# Altium schematic sheet Main_Sch.SchDoc: Controlador PID
size A4; Organization: Altium Limited; Address1: L3, 12a Rodborough Rd; Address2: Frenchs Forest; Address3: NSW; Address4: Australia 2086; Revision: R01; sheetnumberh: 1; sheettotall: 5; Alumno: Irumberry Juan - Matwiejczuk Leandro; Curso: 512; Materia: Técnicas Digitales III; Docentes: Ing. Marín Ariel; SheetNumber: 1; SheetTotal: 5
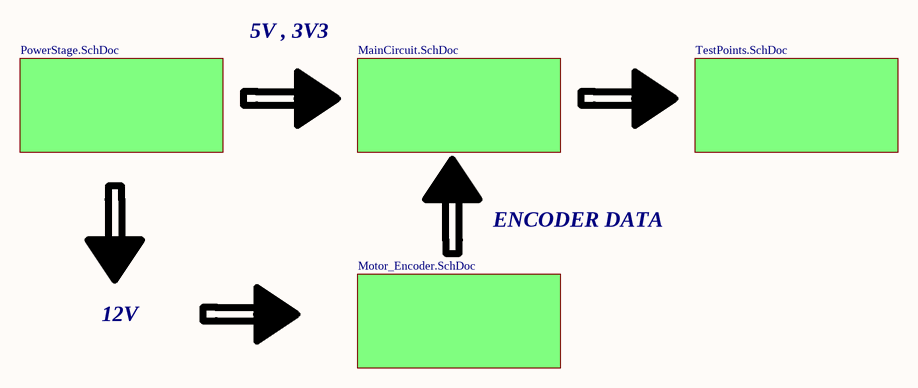
[diagram p0: Main_Sch.SchDoc]

## Sub-sheets
Designator = MainCircuit.SchDoc: no entries
Designator = PowerStage.SchDoc: no entries
Designator = Motor_Encoder.SchDoc: no entries
Designator = TestPoints.SchDoc: no entries

## Notes on the sheet
- 5V , 3V3
- ENCODER DATA
- 12V
- Title:
- Revision:
- Alumnos:
- Materia:
- Docente:
- Curso:
- File:
- Date:
- Sheet
- of